# EAGLE design minimal_osd_v05 (EAGLE 5.11)
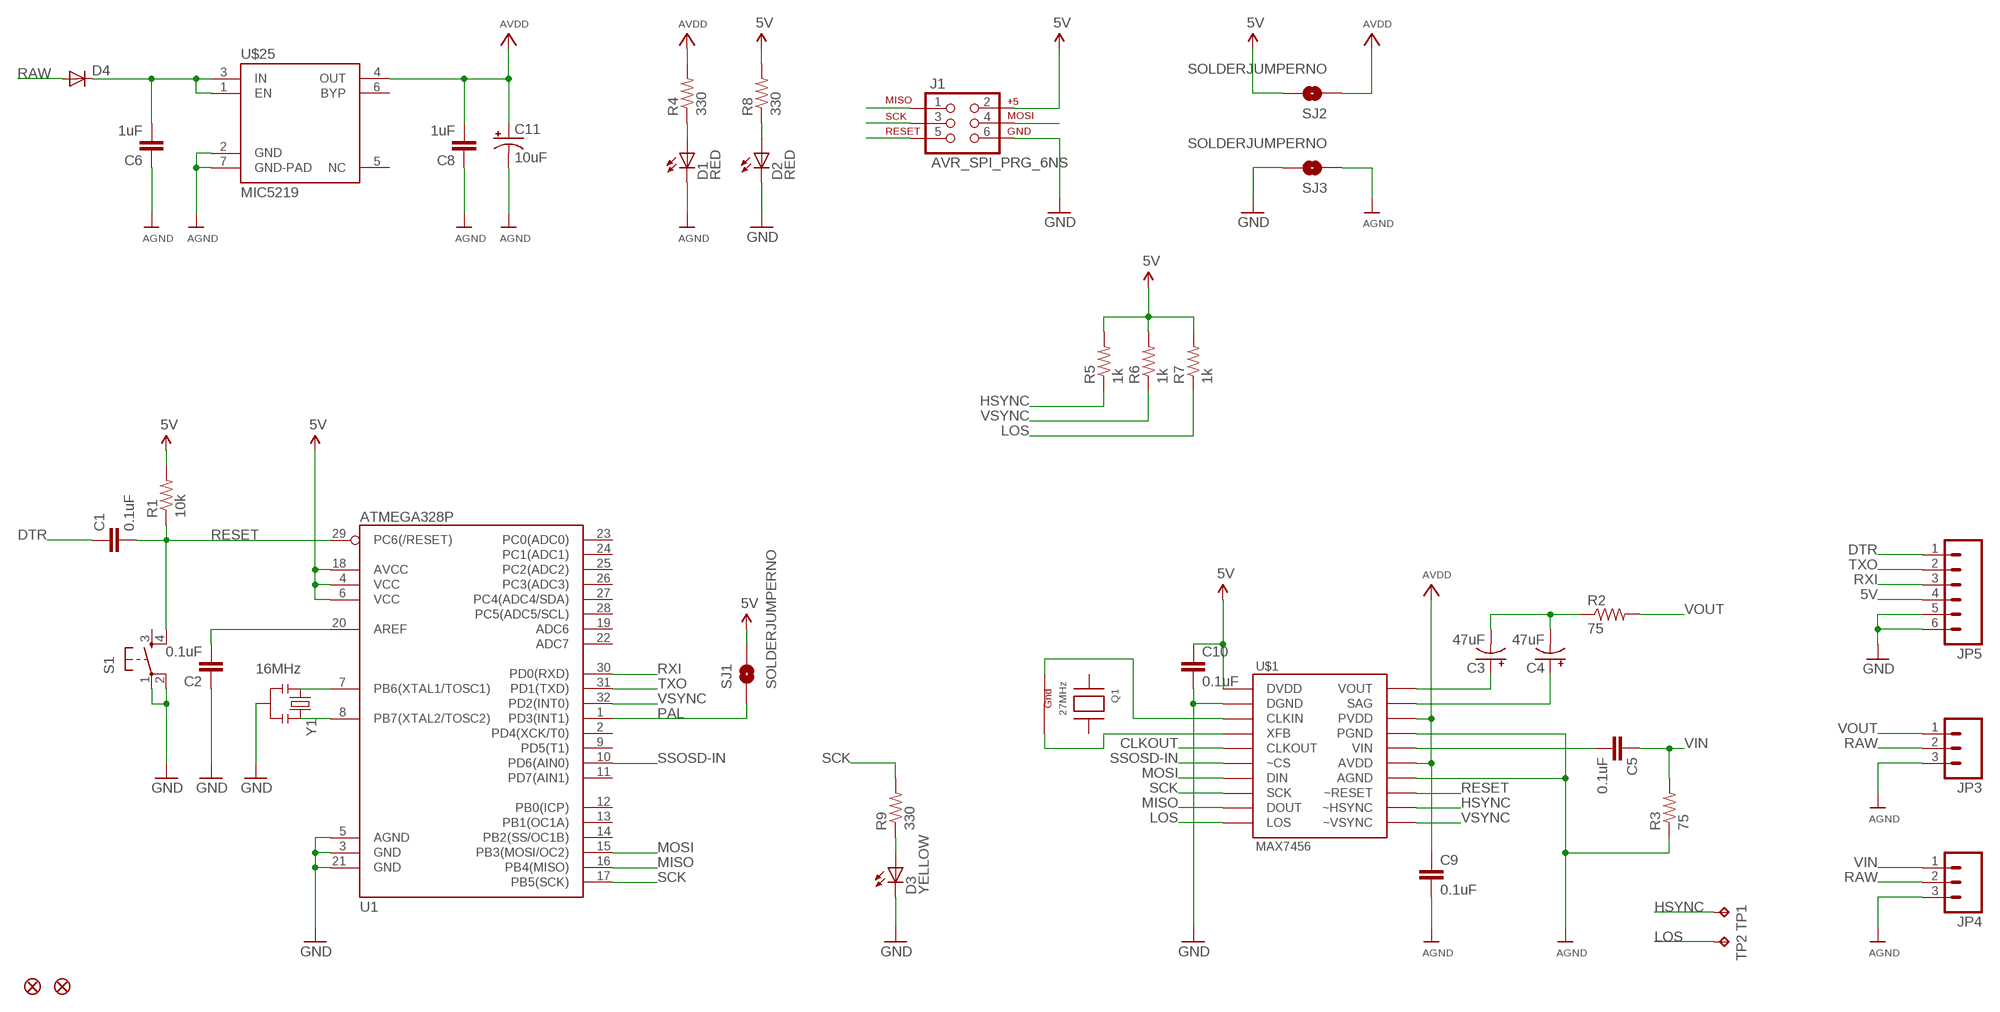
[diagram p0: schematic, sheet 1]

## Parts
C1  0.1uF  CAP0402-CAP  [0402-CAP]
C2  0.1uF  CAP0402-CAP  [0402-CAP]
C3  47uF  CAP_POL3528  [EIA3528]
C4  47uF  CAP_POL3528  [EIA3528]
C5  0.1uF  CAP0402-CAP  [0402-CAP]
C6  1uF  CAP0402-CAP  [0402-CAP]
C8  1uF  CAP0402-CAP  [0402-CAP]
C9  0.1uF  CAP0402-CAP  [0402-CAP]
C10  0.1uF  CAP0402-CAP  [0402-CAP]
C11  10uF  CAP_POL1206  [EIA3216]
D1  RED  LED0603  [LED-0603]
D2  RED  LED0603  [LED-0603]
D3  YELLOW  LED0603  [LED-0603]
D4  DIODE-SOD123  [SOD123]
J1  AVR_SPI_PRG_6NS  [2X3-NS]
JP1  FIDUCIAL1X2  [FIDUCIAL-1X2]
JP2  FIDUCIAL1X2  [FIDUCIAL-1X2]
JP3  M03PTH  [1X03]
JP4  M03PTH  [1X03]
JP5  M06SIP  [1X06]
Q1  27MHz  XTAL-4-3225  [NX3225]
R1  10k  RESISTOR0402-RES  [0402-RES]
R2  75  RESISTOR0402-RES  [0402-RES]
R3  75  RESISTOR0402-RES  [0402-RES]
R4  330  RESISTOR0402-RES  [0402-RES]
R5  1k  RESISTOR0402-RES  [0402-RES]
R6  1k  RESISTOR0402-RES  [0402-RES]
R7  1k  RESISTOR0402-RES  [0402-RES]
R8  330  RESISTOR0402-RES  [0402-RES]
R9  330  RESISTOR0402-RES  [0402-RES]
S1  TAC_SWITCHSMD  [TACTILE_SWITCH_SMD]
SJ1  SOLDERJUMPERNO  [SJ_2S-NO]
SJ2  SOLDERJUMPERNO  [SJ_2S-NO]
SJ3  SOLDERJUMPERNO  [SJ_2S-NO]
TP1  TPTP12SQ  [TP12SQ]
TP2  TPTP12SQ  [TP12SQ]
U1  ATMEGA328P  ATMEGA168  [TQFP32-08]
U$1  MAX7456  [TSSOP28]
U$25  MIC5219  [MLF-6]
Y1  16MHz  RESONATORSMD  [RESONATOR-SMD]

## Nets
5V: C10.1 J1.2 JP5.4 R1.2 R5.2 R6.2 R7.2 R8.2 SJ1.2 SJ2.2 U1.4(VCC) U1.6(VCC) U1.18(AVCC) U$1.3(DVDD)
AGND: C6.1 C8.1 C9.2 C11.C(-) D1.C JP3.3 JP4.3 R3.1 SJ3.1 U$1.20(AGND) U$1.23(PGND) U$25.2(GND) U$25.7(GND-PAD)
AVDD: C8.2 C9.1 C11.A(+) R4.2 SJ2.1 U$1.21(AVDD) U$1.24(PVDD) U$25.4(OUT)
CLKOUT: U$1.7(CLKOUT)
DTR: C1.1 JP5.1
GND: C2.1 C10.2 D2.C D3.C J1.6 JP5.5 JP5.6 S1.1 S1.2 SJ3.2 U1.3(GND) U1.5(AGND) U1.21(GND) U$1.4(DGND) Y1.2
HSYNC: R5.1 TP1.TP U$1.18(~HSYNC)
LOS: R7.1 TP2.TP U$1.12(LOS)
MISO: J1.1 U1.16(PB4(MISO)) U$1.11(DOUT)
MOSI: J1.4 U1.15(PB3(MOSI/OC2)) U$1.9(DIN)
N$1: Q1.4(G2) U$1.6(XFB)
N$2: C2.2 U1.20(AREF)
N$3: U1.7(PB6(XTAL1/TOSC1)) Y1.1
N$4: U1.8(PB7(XTAL2/TOSC2)) Y1.3
N$5: Q1.2(G1) U$1.5(CLKIN)
N$6: C3.A(+) U$1.26(VOUT)
N$7: C4.A(+) U$1.25(SAG)
N$8: C3.C(-) C4.C(-) R2.1
N$9: C5.2 U$1.22(VIN)
N$10: D1.A R4.1
N$11: D2.A R8.1
N$12: C6.2 D4.C U$25.1(EN) U$25.3(IN)
N$13: D3.A R9.1
PAL: SJ1.1 U1.1(PD3(INT1))
RAW: D4.A JP3.2 JP4.2
RESET: C1.2 J1.5 R1.1 S1.4 U1.29(PC6(/RESET)) U$1.19(~RESET)
RXI: JP5.3 U1.30(PD0(RXD))
SCK: J1.3 R9.2 U1.17(PB5(SCK)) U$1.10(SCK)
SSOSD-IN: U1.10(PD6(AIN0)) U$1.8(~CS)
TXO: JP5.2 U1.31(PD1(TXD))
VIN: C5.1 JP4.1 R3.2
VOUT: JP3.1 R2.2
VSYNC: R6.1 U1.32(PD2(INT0)) U$1.17(~VSYNC)
Unconnected: Q1.1(X1) Q1.3(X2) S1.3 U1.2(PD4(XCK/T0)) U1.9(PD5(T1)) U1.11(PD7(AIN1)) U1.12(PB0(ICP)) U1.13(PB1(OC1A)) U1.14(PB2(SS/OC1B)) U1.19(ADC6) U1.22(ADC7) U1.23(PC0(ADC0)) U1.24(PC1(ADC1)) U1.25(PC2(ADC2)) U1.26(PC3(ADC3)) U1.27(PC4(ADC4/SDA)) U1.28(PC5(ADC5/SCL)) U$25.5(NC) U$25.6(BYP)

## Library data of the parts
C1 C2 C5 C6 C8-C10 = SparkFun:CAP: Capacitor Standard 0603 ceramic capacitor, and 0.1" leaded capacitor.
C3 C4 C11 = SparkFun:CAP_POL: Capacitor Polarized These are standard SMD and PTH capacitors. Normally 10uF, 47uF, and 100uF in electrolytic and tantalum varieties. Always verify the external diameter of the through hole cap, it varies with capacity, voltage, and manufacturer. The EIA devices should be standard.
D1-D3 = SparkFun:LED: LEDs Standard schematic elements and footprints for 5mm, 3mm, 1206, and 0603 sized LEDs. 5mm - Spark Fun Electronics SKU : COM-00529 (and others)
D4 = diode:DIODE-: DIODE
J1 = SparkFun:AVR_SPI_PRG_6: AVR ISP 6 Pin This is the reduced ISP connector for AVR programming. Common on Arduino. This footprint will take up less PCB space and can be used with a 10-pin to 6-pin adapter such as SKU: BOB-08508
JP1 JP2 = SparkFun:FIDUCIAL: Fiducial Alignment Points Various fiducial points for machine vision alignment.
JP3 JP4 = SparkFun:M03: Header 3 Standard 3-pin 0.1" header. Use with straight break away headers (SKU : PRT-00116), right angle break away headers (PRT-00553), swiss pins (PRT-00743), machine pins (PRT-00117), and female headers (PRT-00115). Molex polarized connector foot print use with SKU : PRT-08232 with associated crimp pins and housings.
JP5 = SparkFun:M06: Header 6 Standard 6-pin 0.1" header. Use with straight break away headers (SKU : PRT-00116), right angle break away headers (PRT-00553), swiss pins (PRT-00743), machine pins (PRT-00117), and female headers (PRT-00115). Molex polarized connector foot print use with SKU : PRT-08094 with associated crimp pins and housings. NOTES ON THE VARIANTS LOCK and LOCK_LONGPADS... This footprint was designed to help hold the alignment of a through-hole component (i.e. 6-pin header) while soldering it into place. You may notice that each hole has been shifted either up or down by 0.005 of an inch from it's more standard position (which is a perfectly straight line). This slight alteration caused the pins (the squares in the middle) to touch the edges of the holes. Because they are alternating, it causes a "brace" to hold the component in place. 0.005 has proven to be the perfect amount of "off-center" position when using our standard breakaway headers. Although looks a little odd when you look at the bare footprint, once you have a header in there, the alteration is very hard to notice. Also, if you push a header all the way into place, it is covered up entirely on the bottom side. This idea of altering the position of holes to aid alignment will be further integrated into the Sparkfun Library for other footprints. It can help hold any component with 3 or more connection pins.
Q1 = adafruit:XTAL-4: Classic 4-pin 3.2 x 2.5mm crystal
R1-R9 = SparkFun:RESISTOR: Resistor Basic schematic elements and footprints for 0603, 1206, and PTH resistors.
S1 = SparkFun:TAC_SWITCH: Momentary Switch Button commonly used for reset or general input. Spark Fun Electronics SKU : COM-00097
SJ1-SJ3 = SparkFun:SOLDERJUMPER: Solder Jumper Standard SMD solder jumper. Used to automate production. Two varients : Normally Open and Normally Closed are the same, but have different paste layers. NC will have a large amount of paste and should jumper during reflow.
TP1 TP2 = testpad:TP: Test pad
U1 = SparkFun:ATMEGA168
U$1 = SparkFun:MAX7456
U$25 = 3DRobotics:MIC5219: Micrel MIC5219 500mA peak output LDO regulator The MIC5219 is an efficient linear voltage regulator with high peak output current capability, very-low-dropout voltage, and better than 1% output voltage accuracy. Dropout is typically 10mV at light loads and less than 500mV at full load. The MIC5219 is designed to provide a peak output current for start-up conditions where higher inrush current is demanded. It features a 500mA peak output rating. Continuous output current is limited only by package and layout. Features 500mA output current capability SOT-23-5 package - 500mA peak 2mm×2mm MLF® package - 500mA continuous 2mm×2mm Thin MLF® package - 500mA continuous MSOP-8 package - 500mA continuous Low 500mV maximum dropout voltage at full load Extremely tight load and line regulation Tiny SOT-23-5 and MM8? power MSOP-8 package Ultra-low-noise output Low temperature coefficient Current and thermal limiting Reversed-battery protection CMOS/TTL-compatible enable/shutdown control Near-zero shutdown current; DATASHEET: http://www.micrel.com/_PDF/mic5219.pdf; LINK: http://www.micrel.com/page.do?page=/product-info/products/mic5219.shtml; MFGPN: MIC5219
Y1 = SparkFun:RESONATOR: Resonator Small SMD resonator. This is the itty bitty 10/20MHz resonators with built in caps. CSTCE10M0G55 and CSTCE20M0V53. Footprint has been reviewed closely but hasn't been tested yet.

## Board
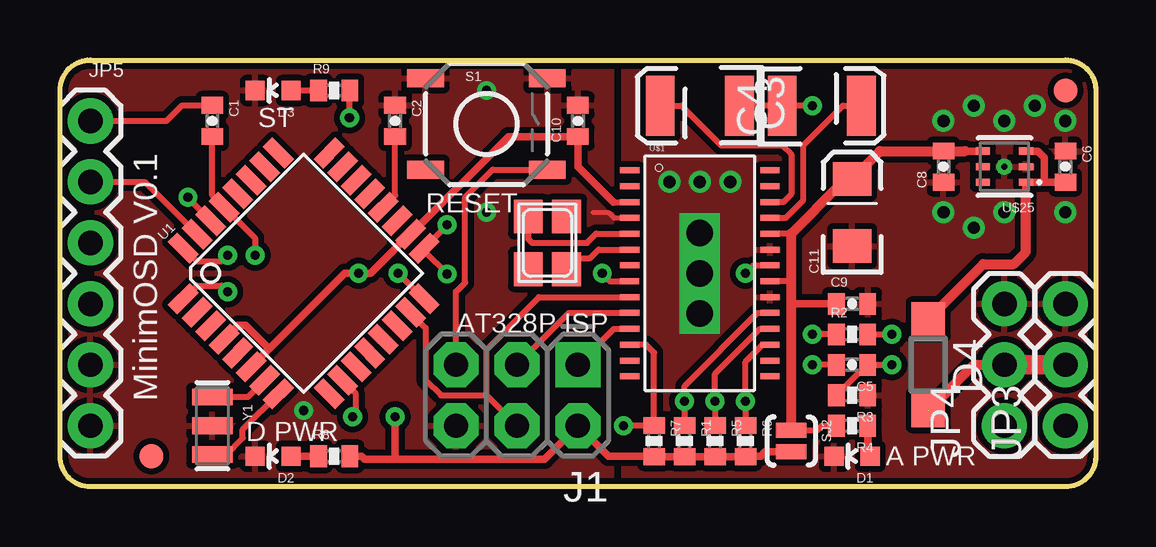
[diagram p1: board, top side]
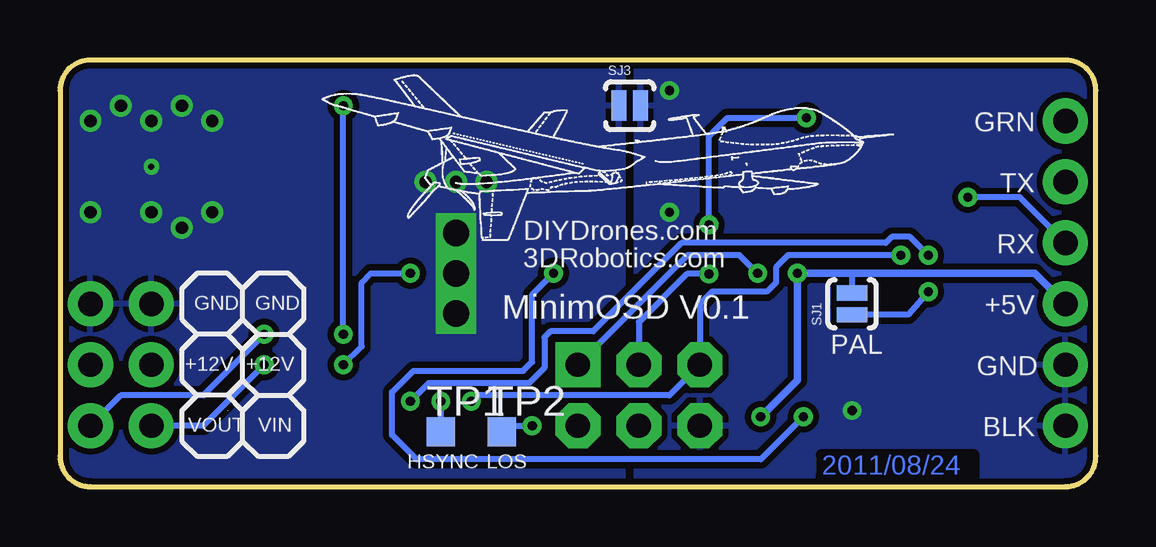
[diagram p2: board, bottom side, seen from below]

Size 43.18 x 17.78 mm. Coordinates in mm from the lower left corner, seen from the top.
Outline: 0,16.51 arc-90 1.27,17.78 41.91,17.78 arc-90 43.18,16.51 43.18,1.27 arc-90 41.91,0 1.27,0 arc-90 0,1.27 0,16.51
Copper layers (1*2+15*16): Top 0.035mm / dielectric 1.5mm / Route2 0.035mm / dielectric 0.15mm / Route15 0.035mm / dielectric 0.2mm / Bottom 0.035mm
Design rules "3DRobotics_4layers *": minimum track width 7mil, minimum drill 15mil, track to track 7mil, track to pad 7mil, pad to pad 7mil, via to via 7mil, smd to smd 0mil, copper to edge 10mil, drill to drill 8mil, minimum pad ring 8mil, minimum via ring 8mil, stop-mask expansion 4mil, vias tented up to drill 25mil, thermal gap 10mil

### Footprints (pad centres in the part's own frame; a part is rotated, then mirrored left to right if it is on the bottom)
0402-CAP = smd 0.7 x 0.9: 1 -0.65,0; 2 0.65,0
EIA3528 = smd 1.2 x 2.5: A 1.65,0; C -1.65,0
EIA3216 = smd 1.4 x 1.6: A 1.4,0; C -1.4,0
LED-0603 = smd 0.8 x 0.8: A 0,-0.75; C 0,0.75
SOD123 = smd 1.4 x 1.4: A 1.9,0; C -1.9,0
2X3-NS = drill 1.016 pad 1.88 square: 1 -2.54,-1.27 | drill 1.016 pad 1.88 octagon: 2 -2.54,1.27; 3 0,-1.27; 4 0,1.27; 5 2.54,-1.27; 6 2.54,1.27
FIDUCIAL-1X2 = smd 1 x 1: 1 0,0
1X03 = drill 1.016 pad 1.88 round: 1 0,0; 2 2.54,0; 3 5.08,0
1X06 = drill 1.016 pad 1.88 round: 1 0,0; 2 2.54,0; 3 5.08,0; 4 7.62,0; 5 10.16,0; 6 12.7,0
NX3225 = smd 1.4 x 1.2: 1 -1.1,0.8; 2 1.1,0.8; 3 1.1,-0.8; 4 -1.1,-0.8
0402-RES = smd 0.7 x 0.9: 1 -0.65,0; 2 0.65,0
TACTILE_SWITCH_SMD = smd 1.524 x 0.762: 1 -2.54,1.905; 2 2.54,1.905; 3 -2.54,-1.905; 4 2.54,-1.905
SJ_2S-NO = smd 0.635 x 1.27: 1 -0.45,0; 2 0.45,0
TP12SQ = smd 1.2 x 1.2: TP 0,0
TQFP32-08 = smd 1.27 x 0.559: 1 -4.293,2.8; 2 -4.293,2; 3 -4.293,1.2; 4 -4.293,0.4; 5 -4.293,-0.4; 6 -4.293,-1.2; 7 -4.293,-2; 8 -4.293,-2.8; 17 4.293,-2.8; 18 4.293,-2; 19 4.293,-1.2; 20 4.293,-0.4; 21 4.293,0.4; 22 4.293,1.2; 23 4.293,2; 24 4.293,2.8 | smd 0.559 x 1.27: 9 -2.8,-4.293; 10 -2,-4.293; 11 -1.2,-4.293; 12 -0.4,-4.293; 13 0.4,-4.293; 14 1.2,-4.293; 15 2,-4.293; 16 2.8,-4.293; 25 2.8,4.293; 26 2,4.293; 27 1.2,4.293; 28 0.4,4.293; 29 -0.4,4.293; 30 -1.2,4.293; 31 -2,4.293; 32 -2.8,4.293
TSSOP28 = smd 0.8 x 0.25: 1 -2.921,4.623; 2 -2.921,3.962; 3 -2.921,3.302; 4 -2.921,2.642; 5 -2.921,1.981; 6 -2.921,1.321; 7 -2.921,0.66; 8 -2.927,0; 9 -2.921,-0.66; 10 -2.921,-1.321; 11 -2.921,-1.981; 12 -2.921,-2.642; 13 -2.921,-3.302; 14 -2.921,-3.962; 15 2.921,-3.962; 16 2.921,-3.302; 17 2.921,-2.642; 18 2.921,-1.981; 19 2.921,-1.321; 20 2.921,-0.66; 21 2.927,0; 22 2.921,0.66; 23 2.921,1.321; 24 2.921,1.981; 25 2.921,2.642; 26 2.921,3.302; 27 2.921,3.962; 28 2.921,4.623
MLF-6 = smd 0.6 x 0.3: 1 -0.9,0.65; 2 -0.9,0; 3 -0.9,-0.65; 4 0.9,-0.65; 5 0.9,0; 6 0.9,0.65 | smd 0.5 x 0.5: 7 0,0
RESONATOR-SMD = smd 0.7 x 1.7: 1 -1.2,0; 2 0,0; 3 1.2,0

### Placement (x,y rotation side)
C1  6.35,15.24 270 top
C2  13.97,15.24 270 top
C3  26.67,15.88 180 top
C4  31.75,15.88 0 top
C5  33.02,5.08 180 top
C6  41.91,13.34 270 top
C8  36.83,13.34 90 top
C9  33.02,7.62 0 top
C10  21.59,15.24 90 top
C11  33.02,11.43 90 top
D1  33.02,1.27 90 top
D2  8.89,1.27 90 top
D3  8.89,16.51 90 top
D4  36.2,5.08 270 top
J1  19.05,3.81 180 top
JP1  3.81,1.27 0 top
JP2  41.91,16.51 0 top
JP3  41.91,2.54 90 top
JP4  39.37,2.54 90 top
JP5  1.27,15.24 270 top
Q1  20.32,10.16 90 top
R1  26.04,1.91 270 top
R2  33.02,6.35 0 top
R3  33.02,3.81 180 top
R4  33.02,2.54 180 top
R5  27.3,1.91 270 top
R6  28.57,1.91 270 top
R7  24.77,1.91 270 top
R8  11.43,1.27 0 top
R9  11.43,16.51 0 top
S1  17.78,15.11 0 top
SJ1  10.16,7.62 90 bottom
SJ2  30.48,1.91 270 top
SJ3  19.43,15.88 0 bottom
TP1  27.3,2.29 0 bottom
TP2  24.77,2.29 0 bottom
U1  10.16,8.89 45 top
U$1  26.67,8.56 0 top
U$22  [UAV_LOGO_1IN]  20.32,13.34 0 bottom
U$25  39.37,13.34 180 top
Y1  6.35,2.54 270 top

### Tracks (layer width: path | path; a pad name or v marks a point on that pad's centre or on a via)
5V  (via drill 0.38)
  Top 0.254: 23.06,11.86 U$1.3
  Top 0.305: 8.79,5.82 U1.6 | U1.4 7.43,6.73 7.75,6.73 8.66,5.82 8.79,5.82 | 8.79,5.82 11.86,8.89 v12.45,8.89 12.95,8.89 14.57,10.51 U1.18 18.69,14.59 C10.1 21.59,13.34 23.06,11.86 | 13.97,1.14 20.19,1.14 J1.2 22.86,1.27 24.75,1.27 R7.2 R1.2 R5.2 R6.2 28.59,1.27 29.21,1.27 29.39,1.46 SJ2.2 | v13.97,2.92 13.97,1.14 | R8.2 12.57,1.27 12.7,1.14 13.97,1.14
  Bottom 0.254: 10.16,8.89 SJ1.2
  Bottom 0.305: JP5.4 2.54,8.89 10.16,8.89 v12.45,8.89 12.45,4.45 v13.97,2.92
AGND  (via drill 0.25, 0.51, 1.1 pad 1.68)
  other vias: 39.37,15.24 38.1,15.88 40.64,15.88 39.37,11.43 38.1,10.79 36.83,15.24 36.83,11.43 41.91,15.24 41.91,11.43 26.67,8.89 26.67,10.57 26.67,7.21 25.4,12.7 26.67,12.7 27.94,12.7 39.37,13.34
  pour Top (isolate 0.254): 23.5,20.32 23.5,0 43.18,0 43.18,20.32
  pour Bottom (isolate 0.254): 19.68,0 19.68,21.59 43.18,21.59 43.18,0
AVDD
  Top 0.254: 30.43,8.56 U$1.21 | SJ2.1 31.57,2.35 31.75,2.54 R4.2 | 30.48,10.54 U$1.24
  Top 0.305: 30.48,8.51 30.43,8.56 | 30.48,7.62 C9.1 | U$25.4 37.73,13.98 37.72,13.97
  Top 0.406: 30.48,8.51 30.48,7.62 SJ2.1 | 30.43,8.56 30.48,8.61 30.48,10.54 32.51,12.57 32.76,12.57 C11.A 34.17,13.98 C8.2 37.73,13.98
DTR
  Top 0.254: C1.1 5.09,15.89 4.45,15.24 JP5.1
GND  (via drill 0.38)
  Top 0.203: U$1.4 23.09,11.2 22.86,11.43 22.23,11.43
  other vias: 17.78,11.43 17.78,16.51 10.16,3.17
  pour Top (isolate 0.254): 0,0 0,20.32 22.99,20.32 22.99,0
  pour Bottom (isolate 0.254): 0,0 0,21.59 19.18,21.59 19.18,0
HSYNC  (via drill 0.38)
  Top 0.254: U$1.18 29.18,6.58 27.3,4.7 v27.3,3.56 R5.1
  Bottom 0.254: TP1.TP v27.3,3.56
LOS  (via drill 0.38)
  Top 0.254: U$1.12 24.43,5.92 24.77,5.59 R7.1 23.51,2.56 v23.5,2.54
  Bottom 0.254: v23.5,2.54 24.51,2.54 TP2.TP
MISO  (via drill 0.38)
  Top 0.203: U1.16 15.15,7.83
  Top 0.254: 15.15,7.83 v14.1,8.89 | U$1.11 23.09,6.58 J1.1
  Bottom 0.254: v14.1,8.89 14.86,9.65 17.02,9.65 J1.1
MOSI
  Top 0.203: U1.15 14.61,7.23
  Top 0.254: 14.61,7.23 15.24,6.6 15.24,4.45 15.88,3.81 17.78,3.81 | 17.78,3.81 J1.4 | 17.78,3.81 17.78,5.71 19.96,7.9 U$1.9
N$1
  Top 0.203: Q1.4 21.59,9.53
  Top 0.254: U$1.6 22.45,9.88 22.1,9.53 21.59,9.53
N$2
  Top 0.254: C2.2 13.97,12.13 U1.20
N$3
  Top 0.254: U1.7 7.84,3.74 Y1.1
N$4
  Top 0.203: Y1.3 6.93,1.34
  Top 0.254: U1.8 7.62,2.39 7.62,2.03 6.93,1.34
N$5
  Top 0.254: U$1.5 22.35,10.54 21.97,10.16 19.68,10.16 19.52,10.32 Q1.2
N$6
  Top 0.254: U$1.26 30.15,11.86 30.48,12.19 30.48,13.84 30.1,14.22 27.56,14.22 25.91,15.88 C3.A
N$7
  Top 0.254: U$1.25 30.25,11.2 30.99,11.94 30.99,14.22 32.64,15.88 C4.A
N$8  (via drill 0.38)
  Top 0.254: R2.1 v31.37,6.35 | C3.C C4.C v31.37,15.88
  Bottom 0.254: v31.37,6.35 v31.37,15.88
N$9  (via drill 0.38)
  Top 0.254: U$1.22 28.91,9.22 v28.57,8.89 | C5.2 v31.37,5.08
  Bottom 0.254: v31.37,5.08 30.61,5.84 30.61,8.51 30.23,8.89 v28.57,8.89
N$10
  Top 0.305: 33.67,2.64 R4.1 33.67,1.37 D1.A
N$11
  Top 0.305: D2.A R8.1
N$12
  Top 0.305: 40.26,12.06 40.26,12.67 U$25.1 41.02,12.69 | 41.02,12.69 C6.2 | U$25.3 40.75,13.98 41.02,13.72 41.02,12.69
  Top 0.406: 36.2,6.86 D4.C 38.49,9.27 39.75,9.27 40.26,9.78 40.26,12.06
N$13
  Top 0.254: D3.A R9.1
PAL  (via drill 0.38)
  Top 0.254: v6.99,8.13 6.73,8.38 5.71,8.38 5.17,7.83 U1.1
  Bottom 0.254: SJ1.1 7.82,7.17 v6.99,8.13
RAW  (1 unrouted)
  Top 0.406: JP4.2 38.1,5.08 D4.A
  Top 0.813: JP4.2 JP3.2
RESET  (via drill 0.38)
  Top 0.203: U1.29 6.76,11.64
  Top 0.254: R1.1 v26.04,3.56 26.04,4.19 29.08,7.24 U$1.19 | v8.13,9.65 8.13,10.36 U1.29 6.35,12.13 C1.2 | S1.4 18.03,13.21 16.89,12.06 16.89,8.51 16.51,8.13 J1.5
  Bottom 0.254: v8.13,9.65 12.83,9.65 13.34,9.14 13.34,8.51 13.72,8.13 16,8.13 16.51,7.62 J1.5 17.78,3.81 25.78,3.81 v26.04,3.56
RXI  (via drill 0.38)
  Top 0.254: U1.30 5.33,12.02 v5.33,12.06
  Bottom 0.254: JP5.3 3.17,12.06 v5.33,12.06
SCK  (via drill 0.38)
  Top 0.203: 16.13,10.9 v16.13,10.92 | 12.06,16.5 R9.2
  Top 0.254: 16.13,10.9 U1.17 15.18,9.82 v16.13,8.87 | v12.06,15.37 12.06,16.5 | U$1.10 21.21,7.24 J1.3
  Bottom 0.254: v12.06,15.37 15.37,15.37 16.13,14.61 v16.13,10.92 | J1.3 19.05,6.86 17.04,8.87 v16.13,8.87
SSOSD-IN  (via drill 0.38)
  Top 0.254: U1.10 12.32,3.9 12.32,3.05 v12.19,2.92 | U$1.8 22.94,8.56 v22.61,8.89
  Bottom 0.254: v12.19,2.92 13.97,1.14 28.32,1.14 29.34,2.16 29.34,3.94 28.45,4.83 23.88,4.83 23.5,5.21 23.5,8 v22.61,8.89
TXO
  Top 0.254: JP5.2 3.52,12.7 U1.31
VIN  (via drill 0.38)
  Top 0.203: 33.64,5.08 C5.1
  Top 0.254: R3.2 33.64,5.08 | C5.1 v34.67,5.08
  Bottom 0.254: v34.67,5.08 37.21,2.54 JP4.1
VOUT  (via drill 0.38)
  Top 0.254: R2.2 v34.67,6.35
  Bottom 0.254: v34.67,6.35 37.21,3.81 40.64,3.81 JP3.1
VSYNC  (via drill 0.38)
  Top 0.254: U$1.17 29.29,5.92 28.57,5.21 v28.57,3.56 R6.1 | U1.32 5.69,9.4 6.73,9.4 v6.99,9.65
  Bottom 0.254: v6.99,9.65 7.75,10.41 8.51,10.41 8.76,10.16 17.27,10.16 20.95,6.48 22.73,6.48 22.99,6.22 22.99,4.95 23.62,4.32 27.81,4.32 v28.57,3.56

### Text on the board
Bottom: 2011/08/24
tPlace: ST | RESET | AT328P ISP | MinimOSD V0.1 | D PWR | A PWR
bPlace: GRN | TX | RX | DIYDrones.com | 3DRobotics.com | +5V | MinimOSD V0.1 | GND | GND | PAL | GND | +12V | +12V | BLK | VIN | VOUT | LOS | HSYNC